# Altium project Urukul.PrjPCB (part 11 of 11)
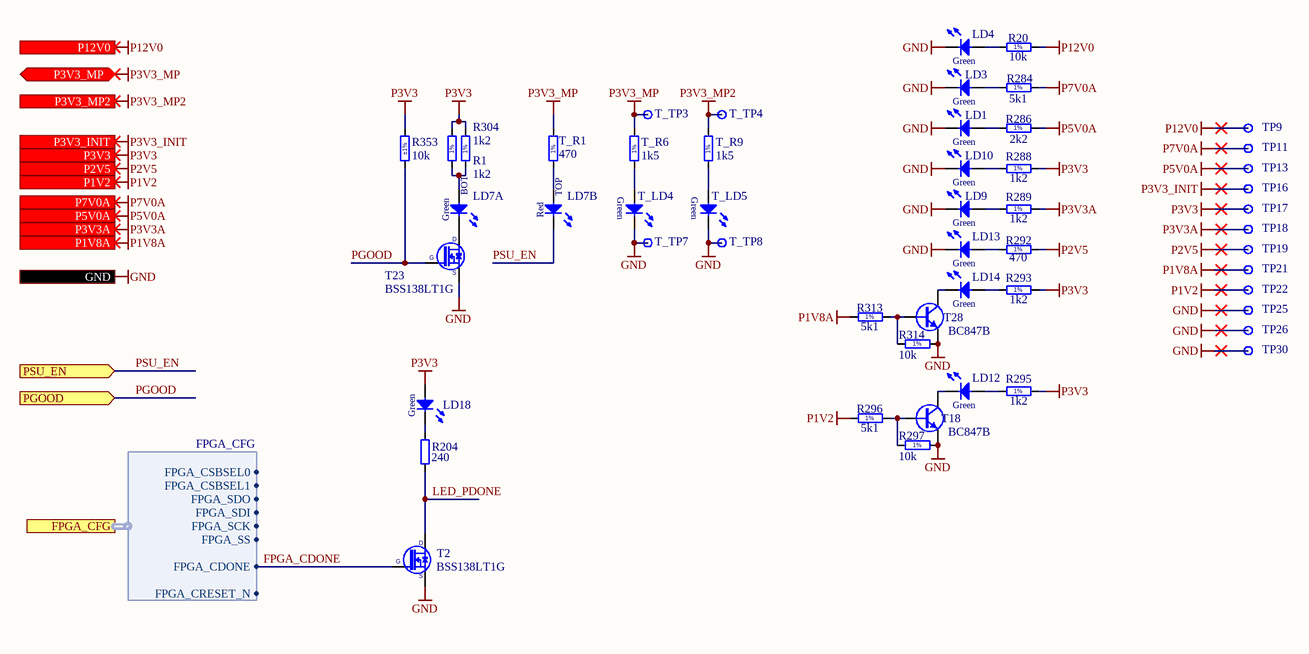
[diagram p20: LEDs.SchDoc]

## Assembly variants
EEM_AD9910: not fitted C30A C30B C30C C30D C44A C44B C44C C44D C50A C50B C50C C50D C57 C58 C59 C60 C62 C69 C72A C72B C72C C72D C80 C88 C92 C93 C107A C107B C107C C107D C112A C112B C112C C112D C127A C127B C127C C127D C128A C128B C128C C128D C133A C133B C133C C133D C134A C134B C134C C134D C135A C135B C135C C135D C136A C136B C136C C136D C137A C137B C137C C137D C138A C138B C138C C138D C139 C140A C140B C140C C140D C141A C141B C141C C141D C142A C142B C142C C142D C143A C143B C143C C143D C144A C144B C144C C144D C146A C146B C146C C146D C147A C147B C147C C147D C148A C148B C148C C148D C149A C149B C149C C149D C150A C150B C150C C150D C164A C164B C164C C164D C172A C172B C172C C172D C176A C176B C176C C176D C180A C180B C180C C180D C191 C195 C202A C202B C202C C202D C203A C203B C203C C203D C204A C204B C204C C204D C205A C205B C205C C205D C206A C206B C206C C206D C207A C207B C207C C207D CLIP1 CLIP2 CLIP3 CLIP4 CLIP5 CLIP6 CLIP7 CLIP8 CLIP9 CLIP10 CLIP11 CLIP12 CLIP13 CLIP14 CLIP15 CLIP16 CLIP17 CLIP18 CLIP19 CLIP20 CLIP21 CLIP22 CLIP23 CLIP24 CLIP25 CLIP26 CLIP27 CLIP28 CLIP29 CLIP30 CLIP31 IC10 IC13A IC13B IC13C IC13D IC22 IC25 J9 J10 L17A L17B L17C L17D L19A L19B L19C L19D L20A L20B L20C L20D L21A L21B L21C L21D OSC2 R3A R3B R3C R3D R4A R4B R4C R4D R8A R8B R8C R8D R12A R12B R12C R12D R15A R15B R15C R15D R22 R34 R37 R42 R48A R48B R48C R48D R49A R49B R49C R49D R50A R50B R50C R50D R51A R51B R51C R51D R60 R61 R62 R63 R66 R69 R70 R71 R72 R76 R77 R79A R79B R79C R79D R86 R89A R89B R89C R89D R91A R91B R91C R91D R93A R93B R93C R93D R94A R94B R94C R94D R95 R96A R96B R96C R96D R97A R97B R97C R97D R98A R98B R98C R98D R99A R99B R99C R99D R101 R102 R103 R104A R104B R104C R104D R105A R105B R105C R105D R106A R106B R106C R106D R107A R107B R107C R107D R110 R113A R113B R113C R113D R120 R121 R134 R136 R140A R140B R140C R140D R150 R151 R163 R164 R166 R167 R168 R178A R178B R178C R178D R190 R191 R193 T_IC3 T_IC5 T_J4 T_J5 T_R2 T_R4 T_R35 T_R36 T_R37 T_R38 T_R39 T_R40 T_R41 T_R42 T_R43 T_R44 T_R45 T_R46 T_R47 T_R48 T_R49 T_R50 T_R51 T_R52 T_R53 T_R54 T_R55 T_R56 T_R57 T_R58 T_R59 T_R60 T_R61 T_R62 T_R63 T_R64 T_R65 T_R66 TR2 TR3 TR4 TR5 TR6 TR7 TR8A TR8B TR8C TR8D; alternate parts T_R26 -> R0805_0R_JUMPER
EEM_AD9912: not fitted C1 C13 C43A C43B C43C C43D C44A C44B C44C C44D C45 C46 C50A C50B C50C C50D C51A C51B C51C C51D C52A C52B C52C C52D C53A C53B C53C C53D C56 C61 C65 C66 C68 C69 C71 C72A C72B C72C C72D C80 C82A C82B C82C C82D C83A C83B C83C C83D C85A C85B C85C C85D C86 C89 C90 C95 C96 C99A C99B C99C C99D C105A C105B C105C C105D C106A C106B C106C C106D C108A C108B C108C C108D C109A C109B C109C C109D C110A C110B C110C C110D C111A C111B C111C C111D C112A C112B C112C C112D C116A C116B C116C C116D C117A C117B C117C C117D C118A C118B C118C C118D C119A C119B C119C C119D C120A C120B C120C C120D C124A C124B C124C C124D C139 C157A C157B C157C C157D C158A C158B C158C C158D C159A C159B C159C C159D C164A C164B C164C C164D C172A C172B C172C C172D C176A C176B C176C C176D C180A C180B C180C C180D C191 C195 C202A C202B C202C C202D C203A C203B C203C C203D C204A C204B C204C C204D C205A C205B C205C C205D C206A C206B C206C C206D C207A C207B C207C C207D CLIP1 CLIP2 CLIP3 CLIP4 CLIP5 CLIP6 CLIP7 CLIP8 CLIP9 CLIP10 CLIP11 CLIP12 CLIP13 CLIP14 CLIP15 CLIP16 CLIP17 CLIP18 CLIP19 CLIP20 CLIP21 CLIP22 CLIP23 CLIP24 CLIP25 CLIP26 CLIP27 CLIP28 CLIP29 CLIP30 CLIP31 IC2A IC2B IC2C IC2D IC4 IC9 IC10 IC16 IC22 IC25 J9 J10 L8 L13 OSC2 R3A R3B R3C R3D R4A R4B R4C R4D R8A R8B R8C R8D R10A R10B R10C R10D R22 R31 R32 R34 R36 R37 R39 R42 R48A R48B R48C R48D R49A R49B R49C R49D R50A R50B R50C R50D R51A R51B R51C R51D R56A R56B R56C R56D R60 R61 R62 R63 R66 R68 R69 R70 R71 R72 R76 R77 R78A R78B R78C R78D R86 R88A R88B R88C R88D R89A R89B R89C R89D R90A R90B R90C R90D R92A R92B R92C R92D R94A R94B R94C R94D R95 R101 R102 R104A R104B R104C R104D R105A R105B R105C R105D R106A R106B R106C R106D R107A R107B R107C R107D R108 R109 R112A R112B R112C R112D R114 R120 R121 R134 R136 R148 R150 R151 R152 R153 R163 R164 R166 R167 R168 R178A R178B R178C R178D R190 R191 R193 T_IC3 T_IC5 T_J4 T_J5 T_R2 T_R4 T_R35 T_R36 T_R37 T_R38 T_R39 T_R40 T_R41 T_R42 T_R43 T_R44 T_R45 T_R46 T_R47 T_R48 T_R49 T_R50 T_R51 T_R52 T_R53 T_R54 T_R55 T_R56 T_R57 T_R58 T_R59 T_R60 T_R61 T_R62 T_R63 T_R64 T_R65 T_R66 TR2 TR3 TR4 TR5 TR6 TR7 TR8A TR8B TR8C TR8D; alternate parts T_R26 -> R0805_0R_JUMPER
DIOT_AD9910: not fitted C30A C30B C30C C30D C44A C44B C44C C44D C50A C50B C50C C50D C57 C58 C59 C60 C62 C69 C72A C72B C72C C72D C80 C88 C92 C93 C107A C107B C107C C107D C112A C112B C112C C112D C127A C127B C127C C127D C128A C128B C128C C128D C133A C133B C133C C133D C134A C134B C134C C134D C135A C135B C135C C135D C136A C136B C136C C136D C137A C137B C137C C137D C138A C138B C138C C138D C139 C140A C140B C140C C140D C141A C141B C141C C141D C142A C142B C142C C142D C143A C143B C143C C143D C144A C144B C144C C144D C146A C146B C146C C146D C147A C147B C147C C147D C148A C148B C148C C148D C149A C149B C149C C149D C150A C150B C150C C150D C164A C164B C164C C164D C172A C172B C172C C172D C176A C176B C176C C176D C180A C180B C180C C180D C191 C195 C202A C202B C202C C202D C203A C203B C203C C203D C204A C204B C204C C204D C205A C205B C205C C205D C206A C206B C206C C206D C207A C207B C207C C207D CLIP1 CLIP2 CLIP3 CLIP4 CLIP5 CLIP6 CLIP7 CLIP8 CLIP9 CLIP10 CLIP11 CLIP12 CLIP13 CLIP14 CLIP15 CLIP16 CLIP17 CLIP18 CLIP19 CLIP20 CLIP21 CLIP22 CLIP23 CLIP24 CLIP25 CLIP26 CLIP27 CLIP28 CLIP29 CLIP30 CLIP31 IC10 IC13A IC13B IC13C IC13D IC22 IC25 J9 J10 L17A L17B L17C L17D L19A L19B L19C L19D L20A L20B L20C L20D L21A L21B L21C L21D OSC2 R3A R3B R3C R3D R4A R4B R4C R4D R8A R8B R8C R8D R12A R12B R12C R12D R15A R15B R15C R15D R21 R22 R34 R37 R42 R47 R48A R48B R48C R48D R49A R49B R49C R49D R50A R50B R50C R50D R51A R51B R51C R51D R53 R60 R61 R62 R63 R69 R70 R71 R72 R76 R77 R79A R79B R79C R79D R89A R89B R89C R89D R91A R91B R91C R91D R93A R93B R93C R93D R94A R94B R94C R94D R95 R96A R96B R96C R96D R97A R97B R97C R97D R98A R98B R98C R98D R99A R99B R99C R99D R101 R102 R103 R104A R104B R104C R104D R105A R105B R105C R105D R106A R106B R106C R106D R107A R107B R107C R107D R110 R113A R113B R113C R113D R120 R121 R134 R136 R140A R140B R140C R140D R150 R151 R164 R166 R167 R168 R178A R178B R178C R178D R190 R191 R193 T_IC3 T_IC5 TR2 TR3 TR4 TR5 TR6 TR7 TR8A TR8B TR8C TR8D
DIOT_AD9912: not fitted C1 C13 C43A C43B C43C C43D C44A C44B C44C C44D C45 C46 C50A C50B C50C C50D C51A C51B C51C C51D C52A C52B C52C C52D C53A C53B C53C C53D C56 C61 C65 C66 C68 C69 C71 C72A C72B C72C C72D C80 C82A C82B C82C C82D C83A C83B C83C C83D C85A C85B C85C C85D C86 C89 C90 C95 C96 C99A C99B C99C C99D C105A C105B C105C C105D C106A C106B C106C C106D C108A C108B C108C C108D C109A C109B C109C C109D C110A C110B C110C C110D C111A C111B C111C C111D C112A C112B C112C C112D C116A C116B C116C C116D C117A C117B C117C C117D C118A C118B C118C C118D C119A C119B C119C C119D C120A C120B C120C C120D C124A C124B C124C C124D C139 C157A C157B C157C C157D C158A C158B C158C C158D C159A C159B C159C C159D C164A C164B C164C C164D C172A C172B C172C C172D C176A C176B C176C C176D C180A C180B C180C C180D C191 C195 C202A C202B C202C C202D C203A C203B C203C C203D C204A C204B C204C C204D C205A C205B C205C C205D C206A C206B C206C C206D C207A C207B C207C C207D CLIP1 CLIP2 CLIP3 CLIP4 CLIP5 CLIP6 CLIP7 CLIP8 CLIP9 CLIP10 CLIP11 CLIP12 CLIP13 CLIP14 CLIP15 CLIP16 CLIP17 CLIP18 CLIP19 CLIP20 CLIP21 CLIP22 CLIP23 CLIP24 CLIP25 CLIP26 CLIP27 CLIP28 CLIP29 CLIP30 CLIP31 IC2A IC2B IC2C IC2D IC4 IC9 IC10 IC16 IC22 IC25 J9 J10 L8 L13 OSC2 R3A R3B R3C R3D R4A R4B R4C R4D R8A R8B R8C R8D R10A R10B R10C R10D R21 R22 R31 R32 R34 R36 R37 R39 R42 R47 R48A R48B R48C R48D R49A R49B R49C R49D R50A R50B R50C R50D R51A R51B R51C R51D R53 R56A R56B R56C R56D R60 R61 R62 R63 R68 R69 R70 R71 R72 R76 R77 R78A R78B R78C R78D R88A R88B R88C R88D R89A R89B R89C R89D R90A R90B R90C R90D R92A R92B R92C R92D R94A R94B R94C R94D R95 R101 R102 R104A R104B R104C R104D R105A R105B R105C R105D R106A R106B R106C R106D R107A R107B R107C R107D R108 R109 R112A R112B R112C R112D R114 R120 R121 R134 R136 R148 R150 R151 R152 R153 R164 R166 R167 R168 R178A R178B R178C R178D R190 R191 R193 T_IC3 T_IC5 TR2 TR3 TR4 TR5 TR6 TR7 TR8A TR8B TR8C TR8D